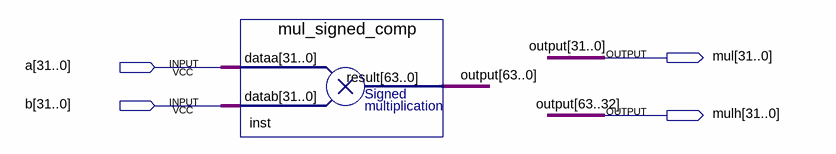
[diagram p0: schematic sheet]
// Quartus schematic mul_mulh.bdf as structural Verilog: 1 symbols, 4 pins
module mul_mulh (
  input  [31:0] a,
  input  [31:0] b,
  output [31:0] mul,
  output [31:0] mulh
);

  mul_signed_comp inst (.dataa(a), .datab(b), .result({mulh, mul}));

  // Other names for the same wires on the sheet: output[63:0] = {mulh, mul}
endmodule
